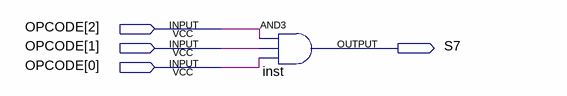
[diagram p0: schematic sheet]
// Quartus schematic DecoASR.bdf as structural Verilog: 1 symbols, 4 pins
module DecoASR (
  input  [2:0] OPCODE,
  output S7
);

  and inst (S7, OPCODE[2], OPCODE[1], OPCODE[0]);
endmodule
